# EAGLE design serial led controller (EAGLE 6.4)

## Sheet 1 of 2
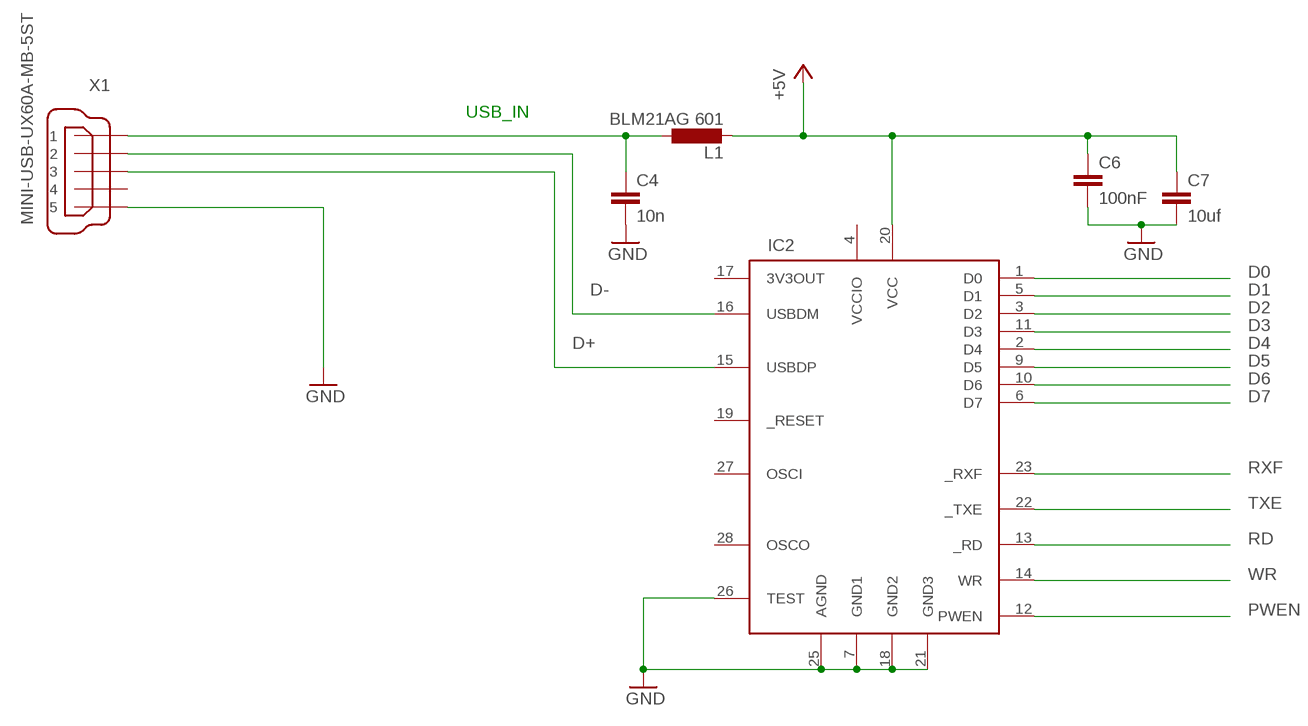
[diagram p0: schematic, sheet 1]

### Parts
C4  10n  C-EUC0603K  [C0603K]
C6  100nF  C-EUC0603K  [C0603K]
C7  10uf  C-EUC0603K  [C0603K]
IC2  FT245RL  [SSOP28DB]
L1  BLM21AG 601  L-EUL805  [L805]
X1  MINI-USB-UX60A-MB-5ST  [UX60A-MB-5ST]

### Nets
+5V: C6.1 C7.1 IC2.20(VCC) L1.2 ; also sheet 2
D0: IC2.1(D0) ; also sheet 2
D1: IC2.5(D1) ; also sheet 2
D2: IC2.3(D2) ; also sheet 2
D3: IC2.11(D3) ; also sheet 2
D4: IC2.2(D4) ; also sheet 2
D5: IC2.9(D5) ; also sheet 2
D6: IC2.10(D6) ; also sheet 2
D7: IC2.6(D7) ; also sheet 2
D+: IC2.15(USBDP) X1.3
D-: IC2.16(USBDM) X1.2
GND: C4.2 C6.2 C7.2 IC2.7(GND1) IC2.18(GND2) IC2.21(GND3) IC2.25(AGND) IC2.26(TEST) X1.5 ; also sheet 2
PWEN: IC2.12(PWEN)
RD: IC2.13(_RD) ; also sheet 2
RXF: IC2.23(_RXF) ; also sheet 2
TXE: IC2.22(_TXE) ; also sheet 2
USBSUPPLY: C4.1 L1.1 X1.1
WR: IC2.14(WR) ; also sheet 2
Unconnected: IC2.17(3V3OUT) IC2.19(_RESET) IC2.27(OSCI) IC2.28(OSCO) X1.4

### Notes on the sheet
- USB_IN

## Sheet 2 of 2
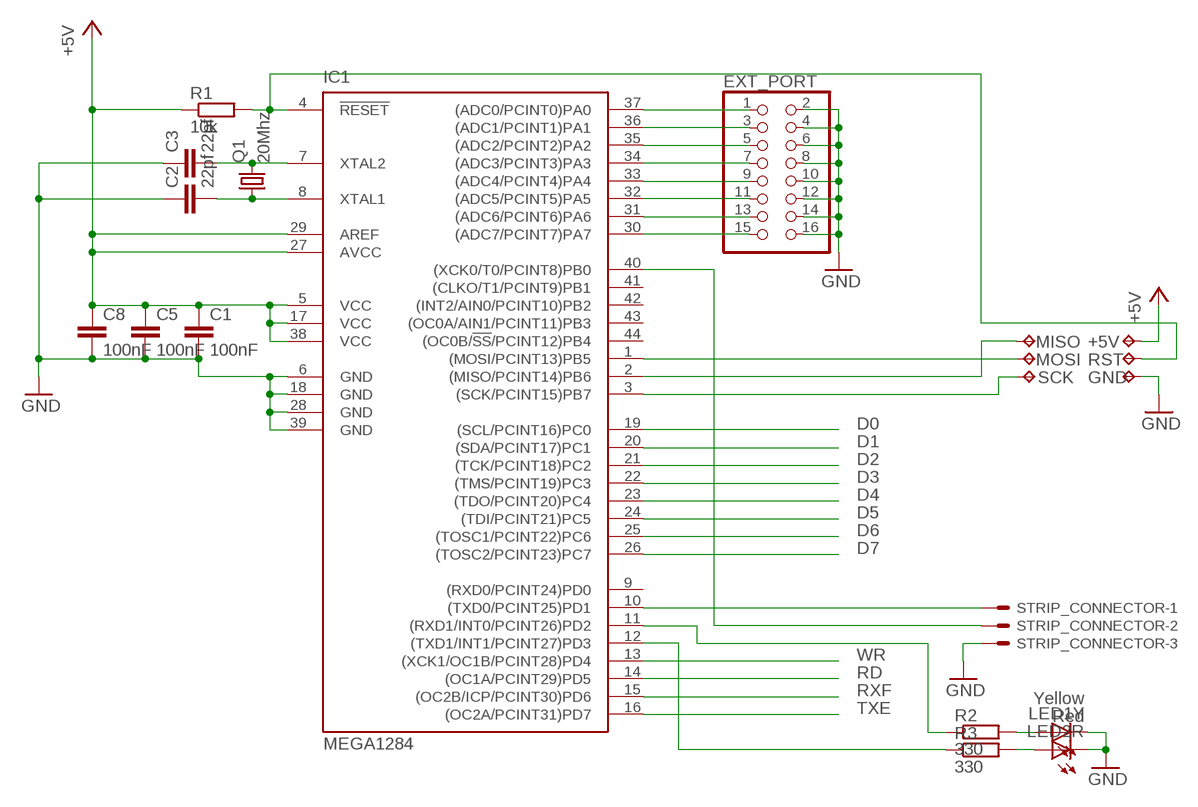
[diagram p1: schematic, sheet 2]

### Parts
+5V  TPTP19R  [TP19R]
C1  100nF  C-EUC0603K  [C0603K]
C2  22pf  C-EUC0603K  [C0603K]
C3  22pf  C-EUC0603K  [C0603K]
C5  100nF  C-EUC0603K  [C0603K]
C8  100nF  C-EUC0603K  [C0603K]
EXT_PORT  PINHD-2X8  [2X08]
GND  TPTP19R  [TP19R]
IC1  MEGA1284  MEGA164P/324P/644P-AU  [TQFP44]
LED1Y  Yellow  LEDCHIP-LED0603  [CHIP-LED0603]
LED2R  Red  LEDCHIP-LED0603  [CHIP-LED0603]
MISO  TPTP19R  [TP19R]
MOSI  TPTP19R  [TP19R]
Q1  20Mhz  CRYSTALSM49  [SM49]
R1  10k  R-EU_603  [R0603]
R2  330  R-EU_603  [R0603]
R3  330  R-EU_603  [R0603]
RST  TPTP19R  [TP19R]
SCK  TPTP19R  [TP19R]
STRIP_CONNECTOR  22-27-2031-03  [6410-03]

### Nets
+5V: +5V.TP C1.1 C5.1 C8.1 IC1.5(VCC) IC1.17(VCC) IC1.27(AVCC) IC1.29(AREF) IC1.38(VCC) R1.1 ; also sheet 1
CLOCK: IC1.40((XCK0/T0/PCINT8)PB0) STRIP_CONNECTOR.2
D0: IC1.19((SCL/PCINT16)PC0) ; also sheet 1
D1: IC1.20((SDA/PCINT17)PC1) ; also sheet 1
D2: IC1.21((TCK/PCINT18)PC2) ; also sheet 1
D3: IC1.22((TMS/PCINT19)PC3) ; also sheet 1
D4: IC1.23((TDO/PCINT20)PC4) ; also sheet 1
D5: IC1.24((TDI/PCINT21)PC5) ; also sheet 1
D6: IC1.25((TOSC1/PCINT22)PC6) ; also sheet 1
D7: IC1.26((TOSC2/PCINT23)PC7) ; also sheet 1
DATA: IC1.10((TXD0/PCINT25)PD1) STRIP_CONNECTOR.1
GND: C1.2 C2.1 C3.1 C5.2 C8.2 EXT_PORT.2 EXT_PORT.4 EXT_PORT.6 EXT_PORT.8 EXT_PORT.10 EXT_PORT.12 EXT_PORT.14 EXT_PORT.16 GND.TP IC1.6(GND) IC1.18(GND) IC1.28(GND) IC1.39(GND) LED1Y.C LED2R.C STRIP_CONNECTOR.3 ; also sheet 1
MISO: IC1.2((MISO/PCINT14)PB6) MISO.TP
MOSI: IC1.1((MOSI/PCINT13)PB5) MOSI.TP
N$1: EXT_PORT.15 IC1.30((ADC7/PCINT7)PA7)
N$2: EXT_PORT.13 IC1.31((ADC6/PCINT6)PA6)
N$3: IC1.11((RXD1/INT0/PCINT26)PD2) R2.1
N$4: EXT_PORT.11 IC1.32((ADC5/PCINT5)PA5)
N$5: EXT_PORT.9 IC1.33((ADC4/PCINT4)PA4)
N$6: IC1.12((TXD1/INT1/PCINT27)PD3) R3.1
N$7: EXT_PORT.7 IC1.34((ADC3/PCINT3)PA3)
N$8: C2.2 IC1.8(XTAL1) Q1.1
N$9: C3.2 IC1.7(XTAL2) Q1.2
N$10: EXT_PORT.5 IC1.35((ADC2/PCINT2)PA2)
N$11: EXT_PORT.3 IC1.36((ADC1/PCINT1)PA1)
N$13: EXT_PORT.1 IC1.37((ADC0/PCINT0)PA0)
N$21: LED1Y.A R2.2
N$22: LED2R.A R3.2
RD: IC1.14((OC1A/PCINT29)PD5) ; also sheet 1
RST: IC1.4(!RESET) R1.2 RST.TP
RXF: IC1.15((OC2B/ICP/PCINT30)PD6) ; also sheet 1
SCK: IC1.3((SCK/PCINT15)PB7) SCK.TP
TXE: IC1.16((OC2A/PCINT31)PD7) ; also sheet 1
WR: IC1.13((XCK1/OC1B/PCINT28)PD4) ; also sheet 1
Unconnected: IC1.9((RXD0/PCINT24)PD0) IC1.41((CLKO/T1/PCINT9)PB1) IC1.42((INT2/AIN0/PCINT10)PB2) IC1.43((OC0A/AIN1/PCINT11)PB3) IC1.44((OC0B/!SS!/PCINT12)PB4)

## Power pins joined to a net without a drawn wire
VCCIO: IC2.4(VCCIO)

## Library data of the parts
+5V GND MISO MOSI RST SCK = testpad:TP: Test pad
C1-C8 = rcl:C-EU: CAPACITOR, European symbol
EXT_PORT = pinhead:PINHD-2X8: PIN HEADER
IC1 = 0_avr:MEGA164P/324P/644P-AU
IC2 = ftdichip-3:FT245RL: USB FIFO Controller 4th Generation USB Controller (USB <-> Parallel) - FIFO
L1 = 0_Standard-Parts:L-EU: INDUCTOR, European symbol
LED1Y LED2R = led:LED: LED OSRAM: - CHIPLED LG R971, LG N971, LY N971, LG Q971, LY Q971, LO R971, LY R971 LH N974, LH R974 LS Q976, LO Q976, LY Q976 LO Q996 - Hyper CHIPLED LW Q18S LB Q993, LB Q99A, LB R99A - SideLED LS A670, LO A670, LY A670, LG A670, LP A670 LB A673, LV A673, LT A673, LW A673 LH A674 LY A675 LS A676, LA A676, LO A676, LY A676, LW A676 LS A679, LY A679, LG A679 - Hyper Micro SIDELED® LS Y876, LA Y876, LO Y876, LY Y876 LT Y87S - SmartLED LW L88C, LW L88S LB L89C, LB L89S, LG L890 LS L89K, LO L89K, LY L89K LS L896, LA L896, LO L896, LY L896 - TOPLED LS T670, LO T670, LY T670, LG T670, LP T670 LSG T670, LSP T670, LSY T670, LOP T670, LYG T670 LG T671, LOG T671, LSG T671 LB T673, LV T673, LT T673, LW T673 LH T674 LS T676, LA T676, LO T676, LY T676, LB T676, LH T676, LSB T676, LW T676 LB T67C, LV T67C, LT T67C, LS T67K, LO T67K, LY T67K, LW E67C LS E67B, LA E67B, LO E67B, LY E67B, LB E67C, LV E67C, LT E67C LW T67C LS T679, LY T679, LG T679 LS T770, LO T770, LY T770, LG T770, LP T770 LB T773, LV T773, LT T773, LW T773 LH T774 LS E675, LA E675, LY E675, LS T675 LS T776, LA T776, LO T776, LY T776, LB T776 LHGB T686 LT T68C, LB T68C - Hyper Mini TOPLED® LB M676 - Mini TOPLED Santana® LG M470 LS M47K, LO M47K, LY M47K Source: http://www.osram.convergy.de LUXEON: - LUMILED® LXK2-PW12-R00, LXK2-PW12-S00, LXK2-PW14-U00, LXK2-PW14-V00 LXK2-PM12-R00, LXK2-PM12-S00, LXK2-PM14-U00 LXK2-PE12-Q00, LXK2-PE12-R00, LXK2-PE12-S00, LXK2-PE14-T00, LXK2-PE14-U00 LXK2-PB12-K00, LXK2-PB12-L00, LXK2-PB12-M00, LXK2-PB14-N00, LXK2-PB14-P00, LXK2-PB14-Q00 LXK2-PR12-L00, LXK2-PR12-M00, LXK2-PR14-Q00, LXK2-PR14-R00 LXK2-PD12-Q00, LXK2-PD12-R00, LXK2-PD12-S00 LXK2-PH12-R00, LXK2-PH12-S00 LXK2-PL12-P00, LXK2-PL12-Q00, LXK2-PL12-R00 Source: www.luxeon.com KINGBRIGHT: KA-3528ASYC Source: www.kingbright.com
Q1 = crystal:CRYSTAL: CRYSTAL; OC_FARNELL: unknown; OC_NEWARK: unknown
R1-R3 = 0_Standard-Parts:R-EU_: RESISTOR, European symbol
STRIP_CONNECTOR = con-molex:22-?-03: CONNECTOR wire to board 2.54 mm (.1 inch) pitch header; OC_FARNELL: unknown; OC_NEWARK: unknown
X1 = con-hirose:MINI-USB-: MINI USB Connector Source: http://www.hirose.co.jp/cataloge_hp/e24000019.pdf; OC_FARNELL: unknown; OC_NEWARK: unknown

## Board
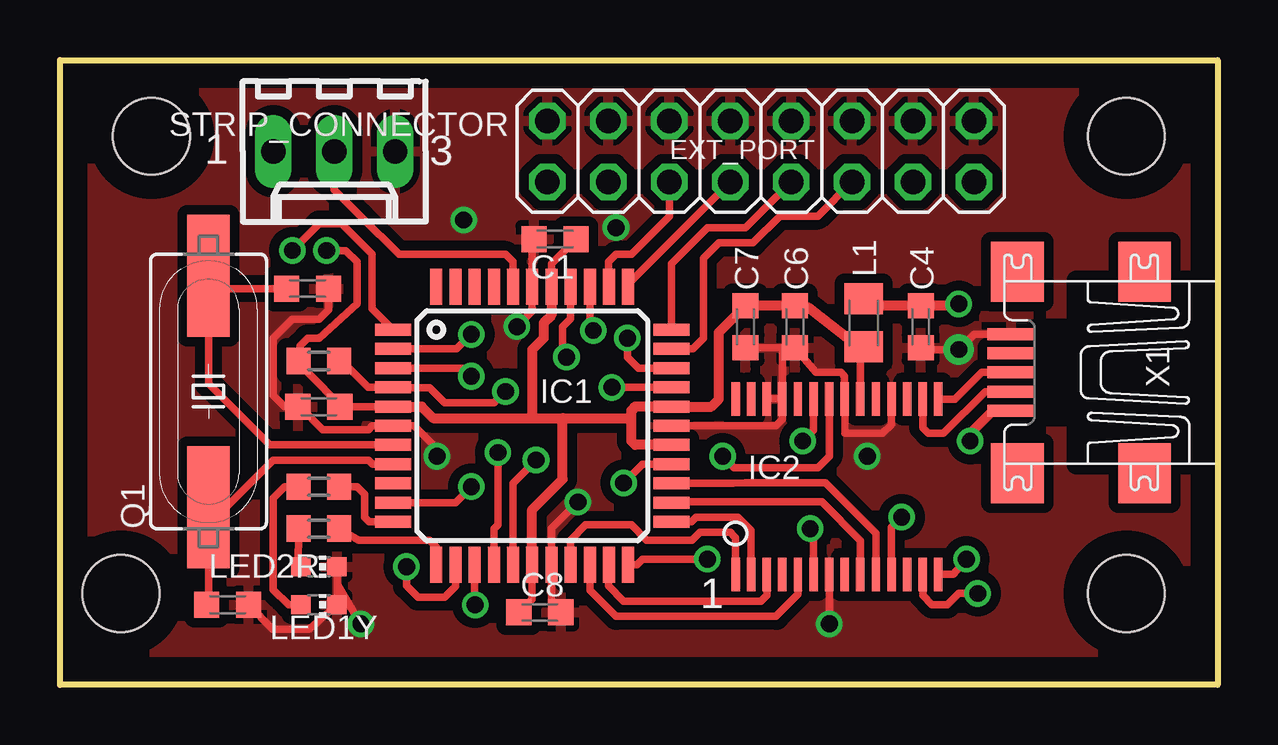
[diagram p2: board, top side]
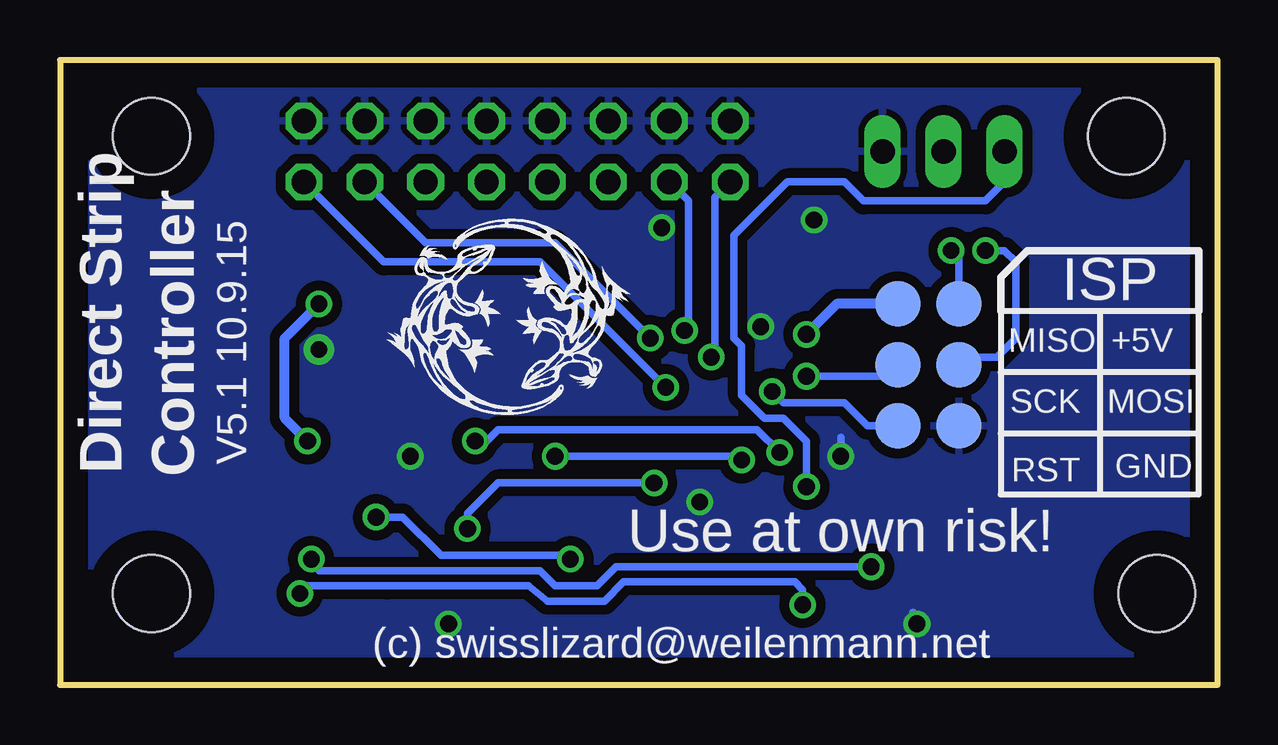
[diagram p3: board, bottom side, seen from below]

Size 48.26 x 26.04 mm. Coordinates in mm from the lower left corner, seen from the top.
Outline: 0,0 0,26.04 48.26,26.04 48.26,0 0,0
Copper layers (1*16): Top 0.035mm / dielectric 1.5mm / Bottom 0.035mm
Design rules "Bilex DRU *": minimum track width 10mil, minimum drill 24mil, track to track 10mil, track to pad 10mil, pad to pad 10mil, via to via 10mil, smd to smd 10mil, copper to edge 40mil, drill to drill 8mil, minimum pad ring 10mil, minimum via ring 8mil, stop-mask expansion 4mil, vias tented up to drill 0mil, thermal gap 10mil
Holes 3.2 mm at 44.45,22.86 44.45,3.81 2.54,3.81 3.81,22.86

### Footprints (pad centres in the part's own frame; a part is rotated, then mirrored left to right if it is on the bottom)
TP19R = smd 1.9 x 1.9: TP 0,0
C0603K = smd 1.05 x 1.08: 1 -0.875,0; 2 0.875,0
2X08 = drill 1.016 octagon: 1 -8.89,-1.27; 2 -8.89,1.27; 3 -6.35,-1.27; 4 -6.35,1.27; 5 -3.81,-1.27; 6 -3.81,1.27; 7 -1.27,-1.27; 8 -1.27,1.27; 9 1.27,-1.27; 10 1.27,1.27; 11 3.81,-1.27; 12 3.81,1.27; 13 6.35,-1.27; 14 6.35,1.27; 15 8.89,-1.27; 16 8.89,1.27
TQFP44 = smd 1.5 x 0.5: 1 -5.8,4; 2 -5.8,3.2; 3 -5.8,2.4; 4 -5.8,1.6; 5 -5.8,0.8; 6 -5.8,0; 7 -5.8,-0.8; 8 -5.8,-1.6; 9 -5.8,-2.4; 10 -5.8,-3.2; 11 -5.8,-4; 23 5.8,-4; 24 5.8,-3.2; 25 5.8,-2.4; 26 5.8,-1.6; 27 5.8,-0.8; 28 5.8,0; 29 5.8,0.8; 30 5.8,1.6; 31 5.8,2.4; 32 5.8,3.2; 33 5.8,4 | smd 0.5 x 1.5: 12 -4,-5.8; 13 -3.2,-5.8; 14 -2.4,-5.8; 15 -1.6,-5.8; 16 -0.8,-5.8; 17 0,-5.8; 18 0.8,-5.8; 19 1.6,-5.8; 20 2.4,-5.8; 21 3.2,-5.8; 22 4,-5.8; 34 4,5.8; 35 3.2,5.8; 36 2.4,5.8; 37 1.6,5.8; 38 0.8,5.8; 39 0,5.8; 40 -0.8,5.8; 41 -1.6,5.8; 42 -2.4,5.8; 43 -3.2,5.8; 44 -4,5.8
SSOP28DB = smd 0.348 x 1.397: 1 -4.225,-3.656; 2 -3.575,-3.656; 3 -2.925,-3.656; 4 -2.275,-3.656; 5 -1.625,-3.656; 6 -0.975,-3.656; 7 -0.325,-3.656; 8 0.325,-3.656; 9 0.975,-3.656; 10 1.625,-3.656; 11 2.275,-3.656; 12 2.925,-3.656; 13 3.575,-3.656; 14 4.225,-3.656; 15 4.225,3.656; 16 3.575,3.656; 17 2.925,3.656; 18 2.275,3.656; 19 1.625,3.656; 20 0.975,3.656; 21 0.325,3.656; 22 -0.325,3.656; 23 -0.975,3.656; 24 -1.625,3.656; 25 -2.275,3.656; 26 -2.925,3.656; 27 -3.575,3.656; 28 -4.225,3.656
L805 = smd 1.3 x 1.6: 1 -1,0; 2 1,0
CHIP-LED0603 = smd 0.8 x 0.8: A 0,-0.75; C 0,0.75
SM49 = smd 5.08 x 1.778: 1 -4.826,0; 2 4.826,0
R0603 = smd 1 x 1.1: 1 -0.85,0; 2 0.85,0
6410-03 = drill 1.016 long: 1 2.54,0; 2 0,0; 3 -2.54,0
UX60A-MB-5ST = smd 2 x 0.5: 1 2.25,1.6; 2 2.25,0.8; 3 2.25,0; 4 2.25,-0.8; 5 2.25,-1.6 | smd 2.2 x 2.5: M1 -3.3,-4.2; M2 -3.3,4.2; M3 2,4.2; M4 2,-4.2

### Placement (x,y rotation side)
+5V  10.79,15.88 270 bottom
C1  20.64,18.57 180 top
C2  6.99,3.33 180 top
C3  10.32,16.51 180 top
C4  35.88,14.92 270 top
C5  10.79,11.59 180 top
C6  30.64,14.92 270 top
C7  28.57,14.92 270 top
C8  20,3.02 0 top
EXT_PORT  29.21,22.23 0 top
GND  10.79,10.79 270 bottom
IC1  19.68,10.79 0 top
IC2  32.38,8.26 0 top
L1  33.5,15.08 270 top
LED1Y  10.79,3.33 270 top
LED2R  10.79,4.92 270 top
MISO  13.34,15.88 270 bottom
MOSI  10.79,13.33 270 bottom
Q1  6.19,12.22 90 top
R1  10.79,13.49 0 top
R2  10.79,8.26 180 top
R3  10.79,6.51 180 top
RST  13.34,10.79 270 bottom
SCK  13.34,13.33 270 bottom
STRIP_CONNECTOR  11.43,22.23 180 top
U$1  [DOUBLE_LIZARD_400]  24.92,11.27 0 top
X1  41.91,13.02 180 top

### Tracks (layer width: path | path; a pad name or v marks a point on that pad's centre or on a via)
+5V  (via drill 0.7)
  Top 0.305: IC2.20 33.36,13.9 | 33.36,13.9 L1.2 | 33.36,13.9 33.09,13.9 | IC1.17 19.68,3.57 C8.1 | 21.59,18.42 C1.1 20.48,17.55 IC1.38 | IC1.5 C5.1 11.75,11.59 10.32,13.02 R1.1 10,13.23 10,14.13 10.32,14.45 10.79,14.45 12.38,15.88 12.38,17.62 11.91,18.1 v11.11,18.1
  Top 0.406: IC1.27 23.98,9.99 23.81,10.16 23.81,11.11 | 23.81,11.11 23.81,11.43 23.98,11.6 IC1.29 27.15,11.6 27.46,11.91 27.46,14.69 C7.1 C6.1 31.2,15.72 33.02,14.29 33.09,13.9 | 20.95,11.11 23.81,11.11 | IC1.17 19.68,7.3 20.95,8.57 20.95,11.11 | IC1.5 15.09,11.6 14.92,11.59 15.08,11.59 15.56,11.11 19.68,11.11 | IC1.38 20.48,15.4 20.16,15.08 20.16,14.45 19.68,13.97 19.68,11.11 | 19.68,11.11 20.95,11.11
  Bottom 0.305: v11.11,18.1 10.79,17.78 +5V.TP
CLOCK
  Top 0.305: STRIP_CONNECTOR.2 11.43,20.64 12.54,19.53 14.13,17.94 15.24,17.94 18.57,17.94 18.89,17.63 IC1.40
D0
  Top 0.305: IC1.19 21.27,5.01 21.27,6.03 21.91,6.67 23.81,6.67 24.45,6.03 26.35,6.03 26.67,6.35 27.94,6.35 28.1,6.19 28.16,6.13 IC2.1
D1
  Top 0.305: IC2.5 30.76,3.77 29.84,2.86 23.18,2.86 22.23,3.81 22.09,3.95 IC1.20
D2
  Top 0.305: IC2.3 29.46,3.74 29.21,3.49 23.5,3.49 22.86,4.13 22.86,4.97 IC1.21
D3  (via drill 0.7)
  Top 0.305: IC1.22 24.05,5 24.29,5.24 v26.99,5.24 | IC2.11 34.66,6.56 v35.08,6.98
  Bottom 0.305: v26.99,5.24 27.15,5.4 32.38,5.4 33.97,6.98 v35.08,6.98
D4
  Top 0.305: IC1.23 26.32,6.79 26.51,6.98 28.26,6.98 28.81,6.43 IC2.2
D5
  Top 0.305: IC2.9 33.36,6.01 31.75,7.62 28.89,7.62 28.26,7.62 25.51,7.62 IC1.24
D6
  Top 0.305: IC1.25 28.08,8.39 28.57,8.41 31.91,8.41 33.81,6.51 34.01,6.31 IC2.10
D7  (via drill 0.7)
  Top 0.305: IC1.26 24.28,9.2 v23.5,8.41 | IC2.6 31.41,6.37 v31.27,6.51
  Bottom 0.305: v23.5,8.41 30,8.41 31.27,7.14 v31.27,6.51
D+
  Top 0.305: X1.3 38.42,13.02 37.31,11.91 IC2.15
D-
  Top 0.305: X1.2 38.57,12.22 36.83,10.48 36.2,10.48 35.96,10.71 IC2.16
DATA  (via drill 0.7)
  Top 0.305: IC1.10 16.48,7.59 v17.14,8.26
  Bottom 0.305: v17.14,8.26 17.14,10.16 18.1,11.11 18.89,11.11 19.84,12.06 19.84,14.13 20.16,14.45 20.16,18.73 19.21,19.69 17.94,20.96 15.56,20.96 14.76,20.16 9.68,20.16 8.89,20.96 8.89,21.59 STRIP_CONNECTOR.1
GND  (via drill 0.7, 0.7 pad 1.27)
  Top 0.305: IC2.26 IC2.25 | IC2.7 32.07,4.61 v32.07,2.54 | IC2.18 34.66,10.85 34.29,10.48 32.72,10.48 32.71,10.48 IC2.21 32.7,12.86 32.54,13.02 31.51,13.02 C6.2 | X1.5 38.11,14.62 v37.47,13.97 35.64,13.97 C4.2 | C6.2 30.16,14.05 | 30.16,14.05 C7.2 | IC2.25 30.11,13.94 30.16,14.05 | 30.56,13.97 C6.2 | C8.2 20.48,3.57 IC1.18 20.48,6.51 v21.59,7.62 | IC1.28 29.84,10.79 30.11,11.06 IC2.25 | v19.05,14.92 19.68,15.56 IC1.39 19.68,18.18 C1.2 | 10.43,2.38 10.38,2.32 | 10.38,2.32 LED1Y.C | LED2R.C LED1Y.C | C3.1 11.19,15.64 10.79,15.24 9.68,15.24 8.89,14.45 8.89,12.06 9.37,11.59 C5.2 10,11.59 10.95,10.64 12.86,10.64 13.02,10.79 IC1.6 14.76,10.79 15.72,9.84 v15.72,9.53 | LED1Y.C 11.59,4.13 v12.54,2.54 | C2.1 8.87,2.32 10.38,2.32
  Bottom 0.305: v19.05,14.92 19.21,14.76 | v21.59,7.62 21.59,7.3 | v15.72,9.53 15.72,10.32 | v12.54,2.54 12.7,3.02
  other vias: 33.66,9.53 16.83,19.37 23.18,19.05
  pour Bottom (isolate 0.406): 46.99,24.77 46.99,1.27 1.27,1.27 1.27,24.77
  pour Top (isolate 0.406): 1.27,24.77 46.99,24.77 46.99,1.27 1.27,1.27
MISO  (via drill 0.7)
  Top 0.305: IC1.2 16.54,13.99 v17.14,14.61
  Bottom 0.406: MISO.TP 15.88,15.88 v17.14,14.61
MOSI  (via drill 0.7)
  Top 0.305: v9.68,18.1 10.79,19.21 11.75,19.21 13.02,17.94 13.02,15.66 IC1.1
  Bottom 0.305: MOSI.TP 10.79,13.65 9.21,13.65 8.41,14.45 8.41,17.62 8.89,18.1 v9.68,18.1
N$1  (via drill 0.7)
  Top 0.305: IC1.30 v23.01,12.39
  Bottom 0.305: v23.01,12.39 23.01,12.37 28.26,17.62 34.77,17.62 EXT_PORT.15
N$2  (via drill 0.7)
  Top 0.305: IC1.31 24.11,13.2 23.65,13.65 v23.65,14.45
  Bottom 0.305: v23.65,14.45 27.62,18.42 33.02,18.42 EXT_PORT.13
N$3
  Top 0.305: IC1.11 12.89,6.79 12.7,6.98 12.7,7.94 12.38,8.26 R2.1
N$4
  Top 0.305: IC1.32 26.38,13.99 26.83,14.45 26.83,17.78 27.46,18.42 28.89,18.42 30,19.53 31.59,19.53 EXT_PORT.11
N$5
  Top 0.305: IC1.33 25.48,17.55 26.99,19.05 28.57,19.05 EXT_PORT.9
N$6
  Top 0.305: IC1.12 15.69,5.75 15.4,6.03 12.44,6.03 R3.1 11.8,6.67
N$7
  Top 0.305: EXT_PORT.7 26.04,19.05 24.13,17.15 23.68,16.7 IC1.34
N$8
  Top 0.305: IC1.8 13.03,9.2 12.86,9.37 8.89,9.37 6.67,7.14 6.67,5.33 Q1.1 6.19,3.89 C2.2
N$9
  Top 0.305: IC1.7 8.74,9.99 6.19,12.54 Q1.2 6.19,16.19 6.51,16.51 C3.2
N$10
  Top 0.305: EXT_PORT.5 25.4,19.53 23.81,17.94 23.18,17.94 22.86,17.62 22.86,16.62 IC1.35
N$11  (via drill 0.7)
  Top 0.305: IC1.36 22.09,14.9 v22.23,14.76
  Bottom 0.305: v22.23,14.76 22.07,14.92 22.07,19.84 22.07,20.16 EXT_PORT.3
N$13  (via drill 0.7)
  Top 0.305: IC1.37 21.29,15.25 20.95,14.92 20.95,13.81 v21.11,13.65
  Bottom 0.305: v21.11,13.65 20.95,13.81 20.95,20.32 EXT_PORT.1
N$21
  Top 0.305: R2.2 9.37,8.26 8.89,7.78 8.89,3.97 9.53,3.33 LED1Y.A
N$22
  Top 0.305: R3.2 9.92,4.89 LED2R.A
RD  (via drill 0.7)
  Top 0.305: IC1.14 17.29,3.35 v17.3,3.33 | IC2.13 35.96,3.73 36.35,3.33 36.99,3.33 37.47,3.81 v38.26,3.81
  Bottom 0.305: v17.3,3.33 17.3,3.97 17.62,4.29 24.77,4.29 25.56,3.49 27.94,3.49 28.73,4.13 34.61,4.13 37.94,4.13 v38.26,3.81
RST  (via drill 0.7)
  Top 0.305: 11.79,13.35 R1.2 12.06,13.18 12.85,12.39 IC1.4 13.9,12.38 15.4,12.38 16.03,11.75 18.1,11.75 v18.57,12.22
  Bottom 0.305: RST.TP 14.61,10.79 15.56,11.75 18.1,11.75 v18.57,12.22
RXF  (via drill 0.7)
  Top 0.305: IC2.23 31.41,10.61 v30.96,10.16 | IC1.15 18.1,5.01 18.1,6.51 18.26,6.67 v18.26,9.68
  Bottom 0.305: v30.96,10.16 30.48,10.16 30,10.64 29.84,10.64 19.21,10.64 v18.26,9.68
SCK  (via drill 0.7)
  Top 0.305: IC1.3 16.81,13.2 v17.14,12.86
  Bottom 0.305: v17.14,12.86 13.81,12.86 SCK.TP
TXE  (via drill 0.7)
  Top 0.305: IC1.16 18.89,8.41 v19.84,9.37 | IC2.22 32.06,11.28 32.07,11.27 32.07,9.53 31.59,9.05 28.1,9.05 v27.62,9.53
  Bottom 0.305: v19.84,9.37 20.16,9.37 20.32,9.53 v27.62,9.53
USBSUPPLY  (via drill 0.7)
  Top 0.406: X1.1 39.65,11.43 38.89,11.43 37.94,10.48 v37.94,10.16 | v37.47,15.88 37.39,15.8 C4.1 33.5,15.8 L1.1
  Bottom 0.406: v37.94,10.16 38.89,11.11 38.89,14.45 v37.47,15.88
WR  (via drill 0.7)
  Top 0.305: IC1.13 16.48,4.1 16.03,3.65 14.92,3.65 14.45,4.13 v14.45,4.92 | v37.78,5.24 37.24,4.6 IC2.14
  Bottom 0.305: v14.45,4.92 25.08,4.92 25.88,4.13 27.62,4.13 28.26,4.76 37.47,4.76 v37.78,5.24

### Text on the board
bNames: Direct Strip | Controller | V5.1 10.9.15 | ISP | Use at own risk! | (c) swisslizard@weilenmann.net